# Altium project main_board.PrjPcb
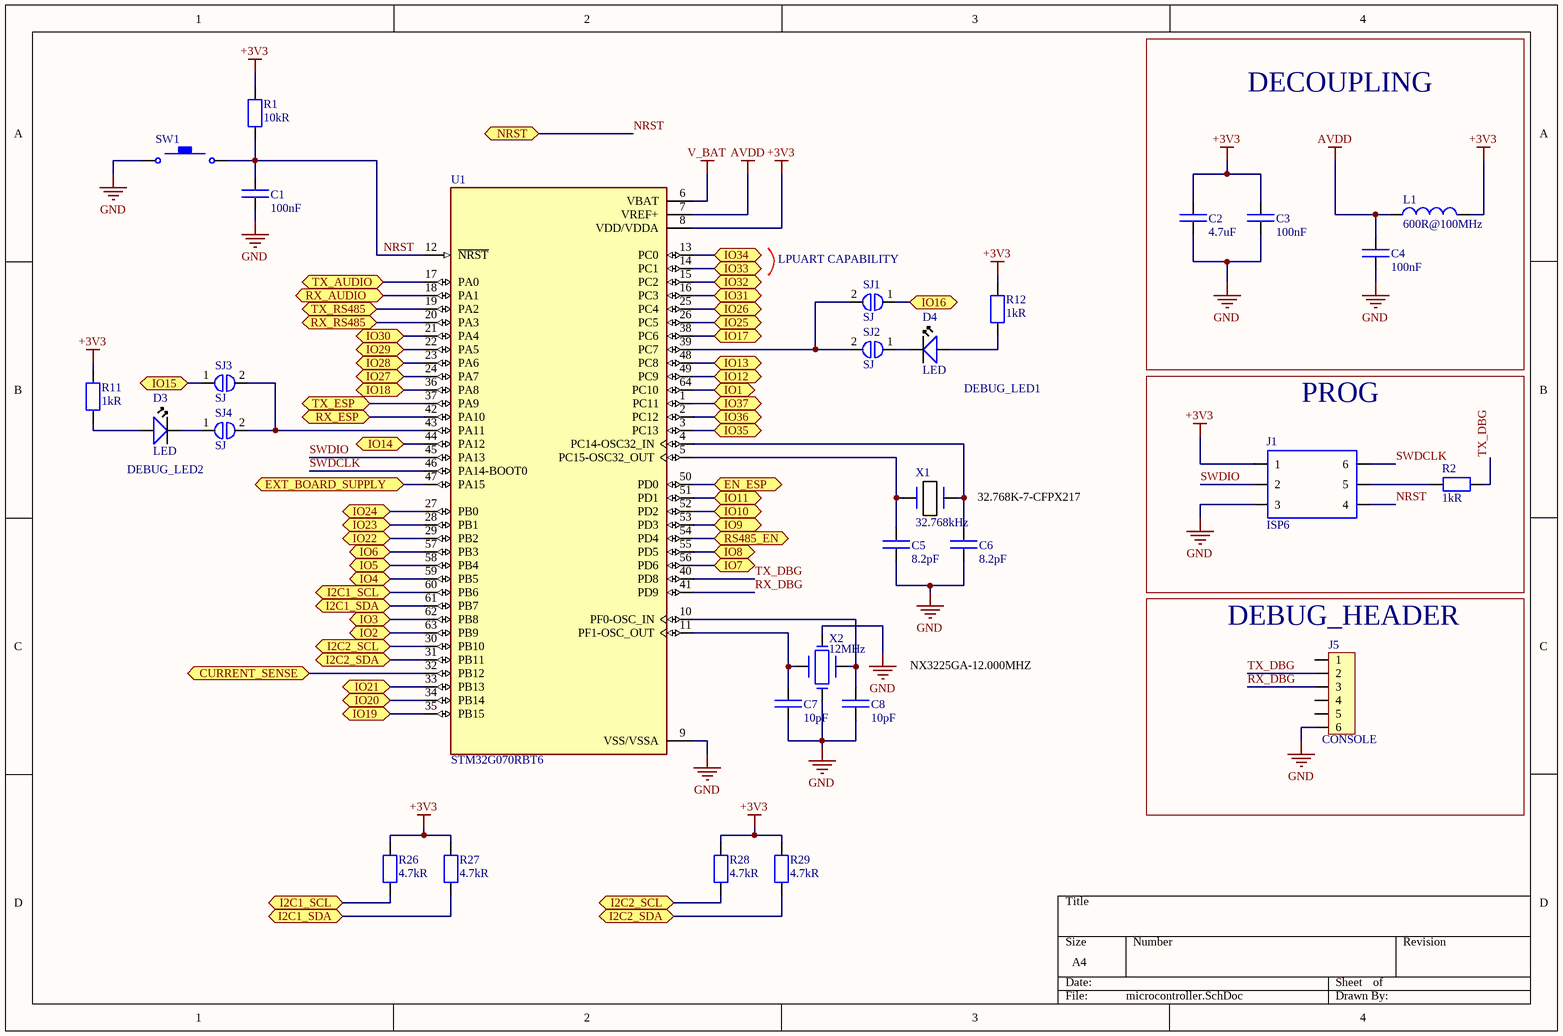
[diagram p0: microcontroller.SchDoc]
6 sheets, 111 parts. Net scope: flat (ports and power ports of the same name join across sheets).
Board file: main_board.PcbDoc
Sheets:
  microcontroller.SchDoc
  power-supply.SchDoc
  Audio.SchDoc
  RS_transceiver.SchDoc
  ESP.SchDoc
  Headers.SchDoc

## Sheet microcontroller.SchDoc
size A4; SheetNumber: 1; SheetTotal: 6

### Parts
C1  100nF  [C0603]
C2  4.7uF  [C0805]
C3  100nF  [C0603]
C4  100nF  [C0603]
C5  8.2pF  [C0603]
C6  8.2pF  [C0603]
C7  10pF  [C0603]
C8  10pF  [C0603]
D3  LED  [LED0805]
D4  LED  [LED0805]
J1  ISP6  [ISP-6]
J5  CONSOLE  [pin_header_6_male]
L1  600R@100MHz  [R0603]
R1  10kR  [R0603]
R2  1kR  [R0603]
R11  1kR  [R0603]
R12  1kR  [R0603]
R26  4.7kR  [R0805]
R27  4.7kR  [R0805]
R28  4.7kR  [R0805]
R29  4.7kR  [R0805]
SJ1  SJ  [SJ]
SJ2  SJ  [SJ]
SJ3  SJ  [SJ]
SJ4  SJ  [SJ]
SW1  tactile_switch  [tact_sw_3mmx4mm]  (value not drawn)
U1  STM32G070RBT6  [STM32]
X1  32.768kHz  [XTAL_2PIN_3.2X1.5mm]
X2  12MHz  [XTAL_4PIN_3.2x2.5mm]

### Blocks framed on the sheet
DECOUPLING: C2-C4 L1
PROG: J1 R2
DEBUG_HEADER: J5

### Ports
CURRENT_SENSE (bidir), EN_ESP (bidir), EXT_BOARD_SUPPLY (bidir), I2C1_SCL (bidir), I2C1_SDA (bidir), I2C2_SCL (bidir), I2C2_SDA (bidir), IO1 (bidir), IO2 (bidir), IO3 (bidir), IO4 (bidir), IO5 (bidir), IO6 (bidir), IO7 (bidir), IO8 (bidir), IO9 (bidir), IO10 (bidir), IO11 (bidir), IO12 (bidir), IO13 (bidir), IO14 (bidir), IO15 (bidir), IO16 (bidir), IO17 (bidir), IO18 (bidir), IO19 (bidir), IO20 (bidir), IO21 (bidir), IO22 (bidir), IO23 (bidir), IO24 (bidir), IO25 (bidir), IO26 (bidir), IO27 (bidir), IO28 (bidir), IO29 (bidir), IO30 (bidir), IO31 (bidir), IO32 (bidir), IO33 (bidir), IO34 (bidir), IO35 (bidir), IO36 (bidir), IO37 (bidir), NRST (bidir), RS485_EN (bidir), RX_AUDIO (bidir), RX_ESP (bidir), RX_RS485 (bidir), TX_AUDIO (bidir), TX_ESP (bidir), TX_RS485 (bidir)

### Nets
+3V3: C2.2 C3.2 J1.1 L1.2 R1.2 R11.2 R12.2 R26.2 R27.2 R28.2 R29.2 U1.8(VDD/VDDA)
AVDD: C4.2 L1.1 U1.7(VREF+)
GND: C1.1 C2.1 C3.1 C4.1 C5.1 C6.1 C7.1 C8.1 J1.3 J5.6 SW1.1 U1.9(VSS/VSSA) X2.2 X2.4
V_BAT: U1.6(VBAT)
NRST: C1.2 J1.4 R1.1 SW1.3 U1.12(~{NRST}) ; port NRST
RX_DBG: J5.3 U1.41(PD9)
SWDCLK: J1.6 U1.46(PA14-BOOT0)
SWDIO: J1.2 U1.45(PA13)
TX_DBG: J5.2 R2.2 U1.40(PD8)
NetC5_2: C5.2 U1.5(PC15-OSC32_OUT) X1.1
NetC6_2: C6.2 U1.4(PC14-OSC32_IN) X1.2
NetC7_2: C7.2 U1.11(PF1-OSC_OUT) X2.1
NetC8_2: C8.2 U1.10(PF0-OSC_IN) X2.3
NetC22_2: U1.32(PB12) ; port CURRENT_SENSE
NetD3_A: D3.A R11.1
NetD3_K: D3.K SJ4.1
NetD4_A: D4.A R12.1
NetD4_K: D4.K SJ2.1
NetD9_K: U1.19(PA2) ; port TX_RS485
NetD10_K: U1.20(PA3) ; port RX_RS485
NetJ1_5: J1.5 R2.1
NetJ7_4: U1.47(PA15) ; port EXT_BOARD_SUPPLY
NetJ7_6: U1.1(PC11) ; port IO37
NetJ7_7: U1.2(PC12) ; port IO36
NetJ7_8: U1.3(PC13) ; port IO35
NetJ7_9: U1.13(PC0) ; port IO34
NetJ7_10: U1.14(PC1) ; port IO33
NetJ7_11: U1.15(PC2) ; port IO32
NetJ7_12: U1.16(PC3) ; port IO31
NetJ7_13: U1.21(PA4) ; port IO30
NetJ7_14: U1.22(PA5) ; port IO29
NetJ7_15: U1.23(PA6) ; port IO28
NetJ7_16: U1.24(PA7) ; port IO27
NetJ7_17: U1.25(PC4) ; port IO26
NetJ7_18: U1.26(PC5) ; port IO25
NetJ7_19: U1.27(PB0) ; port IO24
NetJ7_20: U1.28(PB1) ; port IO23
NetJ7_21: U1.29(PB2) ; port IO22
NetJ7_22: R28.1 U1.30(PB10) ; port I2C2_SCL
NetJ7_23: R29.1 U1.31(PB11) ; port I2C2_SDA
NetJ7_24: U1.33(PB13) ; port IO21
NetJ7_25: U1.34(PB14) ; port IO20
NetJ7_26: U1.35(PB15) ; port IO19
NetJ7_27: U1.36(PA8) ; port IO18
NetJ7_28: U1.38(PC6) ; port IO17
NetJ7_29: SJ1.1 ; port IO16
NetJ7_30: SJ3.1 ; port IO15
NetJ8_1: U1.64(PC10) ; port IO1
NetJ8_2: U1.63(PB9) ; port IO2
NetJ8_3: U1.62(PB8) ; port IO3
NetJ8_4: R27.1 U1.61(PB7) ; port I2C1_SDA
NetJ8_5: R26.1 U1.60(PB6) ; port I2C1_SCL
NetJ8_6: U1.59(PB5) ; port IO4
NetJ8_7: U1.58(PB4) ; port IO5
NetJ8_8: U1.57(PB3) ; port IO6
NetJ8_9: U1.56(PD6) ; port IO7
NetJ8_10: U1.55(PD5) ; port IO8
NetJ8_11: U1.53(PD3) ; port IO9
NetJ8_12: U1.52(PD2) ; port IO10
NetJ8_13: U1.51(PD1) ; port IO11
NetJ8_14: U1.49(PC9) ; port IO12
NetJ8_15: U1.48(PC8) ; port IO13
NetJ8_16: U1.44(PA12) ; port IO14
NetJ10_2: U1.37(PA9) ; port TX_ESP
NetJ10_3: U1.42(PA10) ; port RX_ESP
NetR7_1: U1.17(PA0) ; port TX_AUDIO
NetSJ1_2: SJ1.2 SJ2.2 U1.39(PC7)
NetSJ3_2: SJ3.2 SJ4.2 U1.43(PA11)
NetSJ6_1: U1.50(PD0) ; port EN_ESP
NetU1_18: U1.18(PA1) ; port RX_AUDIO
NetU1_54: U1.54(PD4) ; port RS485_EN

Not connected (* = marked no-connect by the designer): J5 1 4 5

### Notes on the sheet
- (near SJ1) LPUART CAPABILITY
- DEBUG_LED1
- DEBUG_LED2
- 32.768K-7-CFPX217
- NX3225GA-12.000MHZ

### Library data of the parts
C1-C8 = Cap_SMD
J5 = GOLDPIN_6
L1 = Inductor
R1 R2 R11 R12 R26-R29 = Res
U1 = STM32G070RBT6: ARMÂ® CortexÂ®-M0+ STM32G0 Microcontroller IC 32-Bit 64MHz 128KB _128K x 8_ FLASH 64-LQFP _10x10_; MF: STMicroelectronics; Package: LQFP-64 STMicroelectronics; MP: STM32G070RBT6; Value: *; Availability: Unavailable; SnapEDA_Link: https://www.snapeda.com/parts/STM32G070RBT6/STMicroelectronics/view-part/3616430/?ref=snap; Price: None
X1 = XTAL_2PIN: 32.768K-7-CFPX217
X2 = XTAL_4PIN: NX3225GA-12.000MHZ

## Sheet power-supply.SchDoc
size A4; SheetNumber: 2; SheetTotal: 6
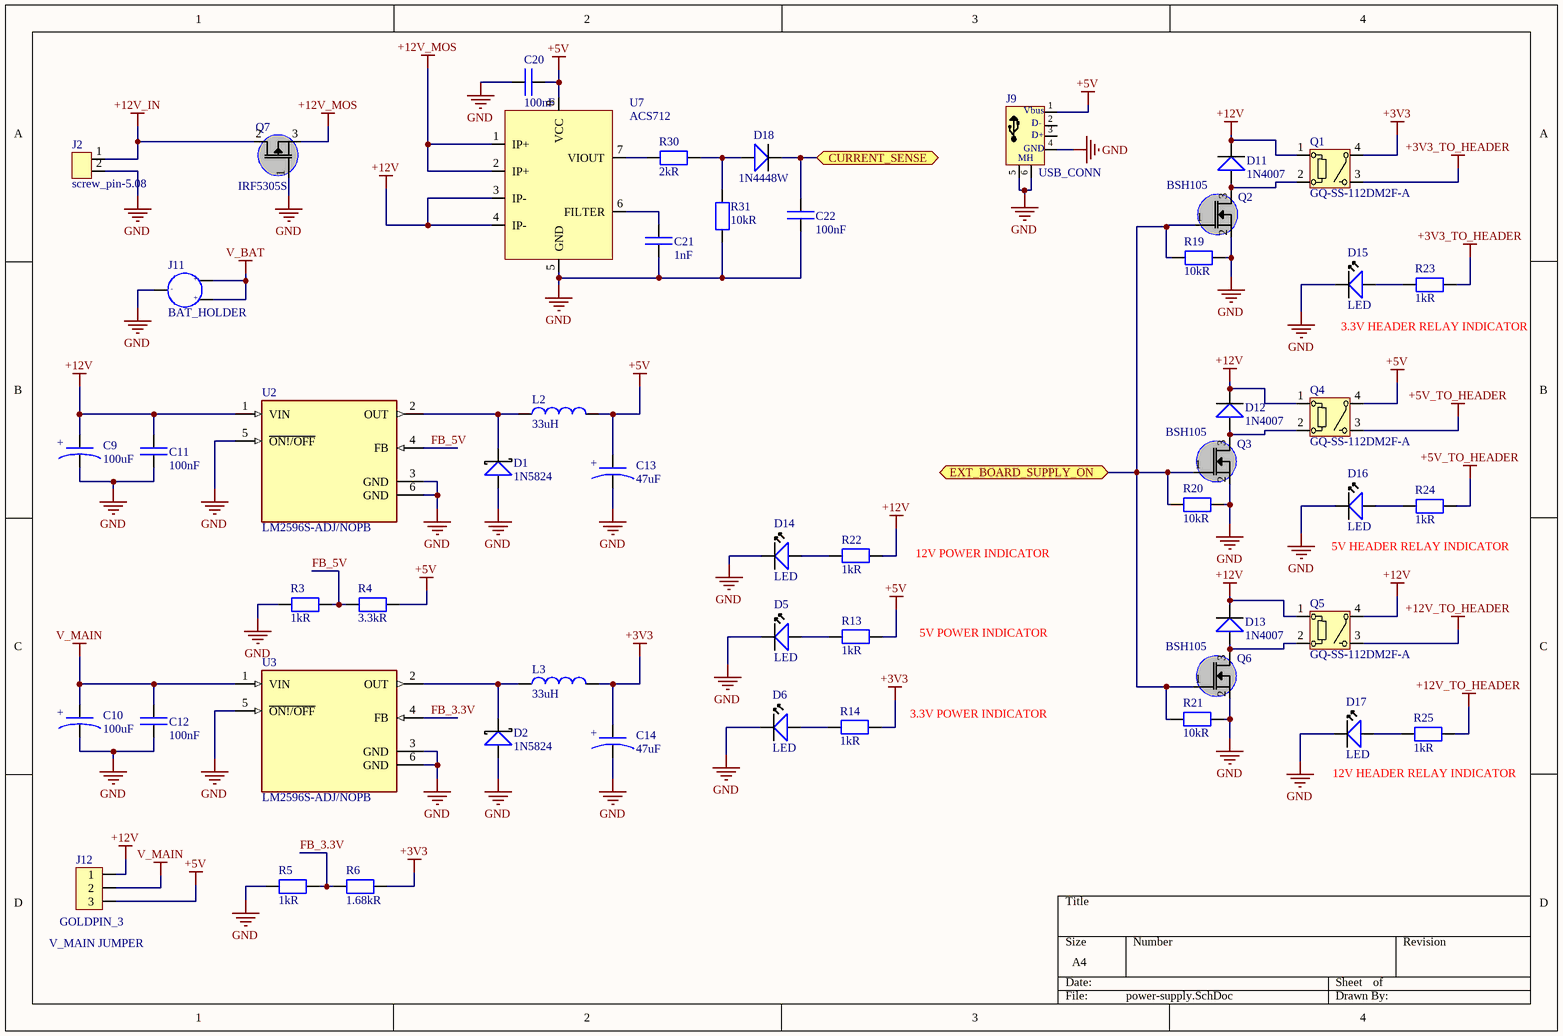
[diagram p1: power-supply.SchDoc]

### Parts
C9  100uF  [C_Pol_6.3x7.7]
C10  100uF  [C_Pol_6.3x7.7]
C11  100nF  [C0603]
C12  100nF  [C0603]
C13  47uF  [C_Pol_6.3x7.7]
C14  47uF  [C_Pol_6.3x7.7]
C20  100nF  [C0603]
C21  1nF  [C0603]
C22  100nF  [C0603]
D1  1N5824  [DO-214AA]
D2  1N5824  [DO-214AA]
D5  LED  [LED0805]
D6  LED  [LED0805]
D11  1N4007  [D_SMA]
D12  1N4007  [D_SMA]
D13  1N4007  [D_SMA]
D14  LED  [LED0805]
D15  LED  [LED0805]
D16  LED  [LED0805]
D17  LED  [LED0805]
D18  1N4448W  [SOD123F]
J2  screw_pin-5.08  [screw_pin-5.08]
J9  USB_CONN  [USB_A]
J11  BAT_HOLDER  [BAT_HOLDER]
J12  GOLDPIN_3  [PIN_HEADER_3_MALE]
L2  33uH  [SRR1260-330M]
L3  33uH  [SRR1260-330M]
Q1  GQ-SS-112DM2F-A  [GQ-SS-112DM2F-a]
Q2  BSH105  [SOT23]
Q3  BSH105  [SOT23]
Q4  GQ-SS-112DM2F-A  [GQ-SS-112DM2F-a]
Q5  GQ-SS-112DM2F-A  [GQ-SS-112DM2F-a]
Q6  BSH105  [SOT23]
Q7  IRF5305S  [DDPAK]
R3  1kR  [R0603]
R4  3.3kR  [R0603]
R5  1kR  [R0603]
R6  1.68kR  [R0603]
R13  1kR  [R0603]
R14  1kR  [R0603]
R19  10kR  [R0805]
R20  10kR  [R0805]
R21  10kR  [R0805]
R22  1kR  [R0603]
R23  1kR  [R0603]
R24  1kR  [R0603]
R25  1kR  [R0603]
R30  2kR  [R0603]
R31  10kR  [R0603]
U2  LM2596S-ADJ/NOPB  [TO-263]
U3  LM2596S-ADJ/NOPB  [TO-263]
U7  ACS712  [SOIC-8]

### Ports
CURRENT_SENSE (bidir), EXT_BOARD_SUPPLY_ON (bidir)

### Nets
+3V3: C14.1 L3.2 Q1.4 R6.2 R14.2
+3V3_TO_HEADER: Q1.3 R23.2
+5V: C13.1 C20.1 J9.1 J12.3 L2.2 Q4.4 R4.2 R13.2 U7.8(VCC)
+5V_TO_HEADER: Q4.3 R24.2
+12V: C9.1 C11.2 D11.K D12.K D13.K J12.1 Q1.1 Q4.1 Q5.1 Q5.4 R22.2 U2.1(VIN) U7.3(IP-) U7.4(IP-)
+12V_IN: J2.1 Q7.2
+12V_MOS: Q7.3 U7.1(IP+) U7.2(IP+)
+12V_TO_HEADER: Q5.3 R25.2
GND: C9.2 C10.2 C11.1 C12.1 C13.2 C14.2 C20.2 C21.1 C22.1 D1.A D2.A D5.K D6.K D14.K D15.K D16.K D17.K J2.2 J9.4 J9.5 J9.6 J11.3(-) Q2.2 Q3.2 Q6.2 Q7.1(G) R3.1 R5.1 R19.2 R20.2 R21.2 R31.1 U2.3(GND) U2.5(~{ON!/OFF}) U2.6(GND) U3.3(GND) U3.5(~{ON!/OFF}) U3.6(GND) U7.5(GND)
V_BAT: J11.1(+) J11.2(+)
V_MAIN: C10.1 C12.2 J12.2 U3.1(VIN)
FB_3.3V: R5.2 R6.1 U3.4(FB)
FB_5V: R3.2 R4.1 U2.4(FB)
NetC21_2: C21.2 U7.6(FILTER)
NetC22_2: C22.2 D18.K ; port CURRENT_SENSE
NetD1_K: D1.K L2.1 U2.2(OUT)
NetD2_K: D2.K L3.1 U3.2(OUT)
NetD5_A: D5.A R13.1
NetD6_A: D6.A R14.1
NetD11_A: D11.A Q1.2 Q2.3
NetD12_A: D12.A Q3.3 Q4.2
NetD13_A: D13.A Q5.2 Q6.3
NetD14_A: D14.A R22.1
NetD15_A: D15.A R23.1
NetD16_A: D16.A R24.1
NetD17_A: D17.A R25.1
NetD18_A: D18.A R30.1 R31.2
NetJ7_1: Q2.1(G) Q3.1(G) Q6.1(G) R19.1 R20.1 R21.1 ; port EXT_BOARD_SUPPLY_ON
NetR30_2: R30.2 U7.7(VIOUT)

Not connected (* = marked no-connect by the designer): J9 2(D-) 3(D+)

### Notes on the sheet
- 3.3V HEADER RELAY INDICATOR
- (near R22) 12V POWER INDICATOR
- 5V HEADER RELAY INDICATOR
- (near R13) 5V POWER INDICATOR
- (near R14) 3.3V POWER INDICATOR
- 12V HEADER RELAY INDICATOR
- (near J12) V_MAIN JUMPER
- (in symbol Cap_SMD_elec) +
- (in symbol USB_CONN) Vbus; GND; MH

### Library data of the parts
C9 C10 C13 C14 = Cap_SMD_elec
C11 C12 C20-C22 = Cap_SMD
D1 D2 = Schottky_diode
D11-D13 D18 = Diode
L2 L3 = Inductor
Q2 Q3 Q6 = MOSFET_N
R3-R6 R13 R14 R19-R25 R30 R31 = Res
U2 U3 = LM2596S-ADJ/NOPB: SIMPLE SWITCHER&reg; 4.5V to 40V, 3A Low Component Count Step-Down Regulator 5-DDPAK/TO-263 -40 to 125; MF: Texas Instruments; MP: LM2596S-ADJ/NOPB; Price: None; Availability: Unavailable; SnapEDA_Link: https://www.snapeda.com/parts/LM2596S-ADJ/NOPB/Texas%20Instruments/view-part/276908/?ref=snap; Texas_Instruments-Purchase-URL: https://snapeda.com/shop?store=Texas+Instruments&id=276908; Value: *; Mouser-Purchase-URL: https://snapeda.com/shop?store=Mouser&id=276908; Package: TO-263-5 Texas Instruments; DigiKey-Purchase-URL: https://snapeda.com/shop?store=DigiKey&id=276908

## Sheet Audio.SchDoc
size A4; SheetNumber: 3; SheetTotal: 6
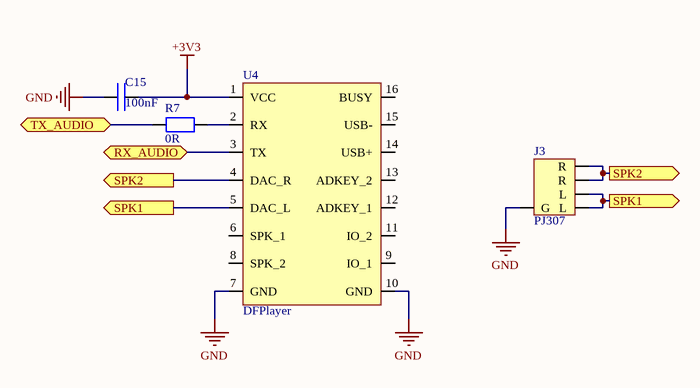
[diagram p2: Audio.SchDoc]

### Parts
C15  100nF  [C0603]
J3  PJ307  [PJ307]
R7  0R  [R0603]
U4  DFPlayer  [DFPLAYER]

### Ports
RX_AUDIO (bidir), SPK1 (out), SPK2 (out), TX_AUDIO (bidir)

### Nets
+3V3: C15.2 U4.1(VCC)
GND: C15.1 J3.1(G) U4.7(GND) U4.10(GND)
NetJ3_2: J3.2(L) J3.3(L) U4.5(DAC_L) ; port SPK1
NetJ3_4: J3.4(R) J3.5(R) U4.4(DAC_R) ; port SPK2
NetR7_1: R7.1 ; port TX_AUDIO
NetR7_2: R7.2 U4.2(RX)
NetU1_18: U4.3(TX) ; port RX_AUDIO

Not connected (* = marked no-connect by the designer): U4 6(SPK_1) 8(SPK_2) 9(IO_1) 11(IO_2) 12(ADKEY_1) 13(ADKEY_2) 14(USB+) 15(USB-) 16(BUSY)

### Library data of the parts
C15 = Cap_SMD
J3 = Jack_3.5mm_PJ307
R7 = Res

## Sheet RS_transceiver.SchDoc
size A4; SheetNumber: 4; SheetTotal: 6
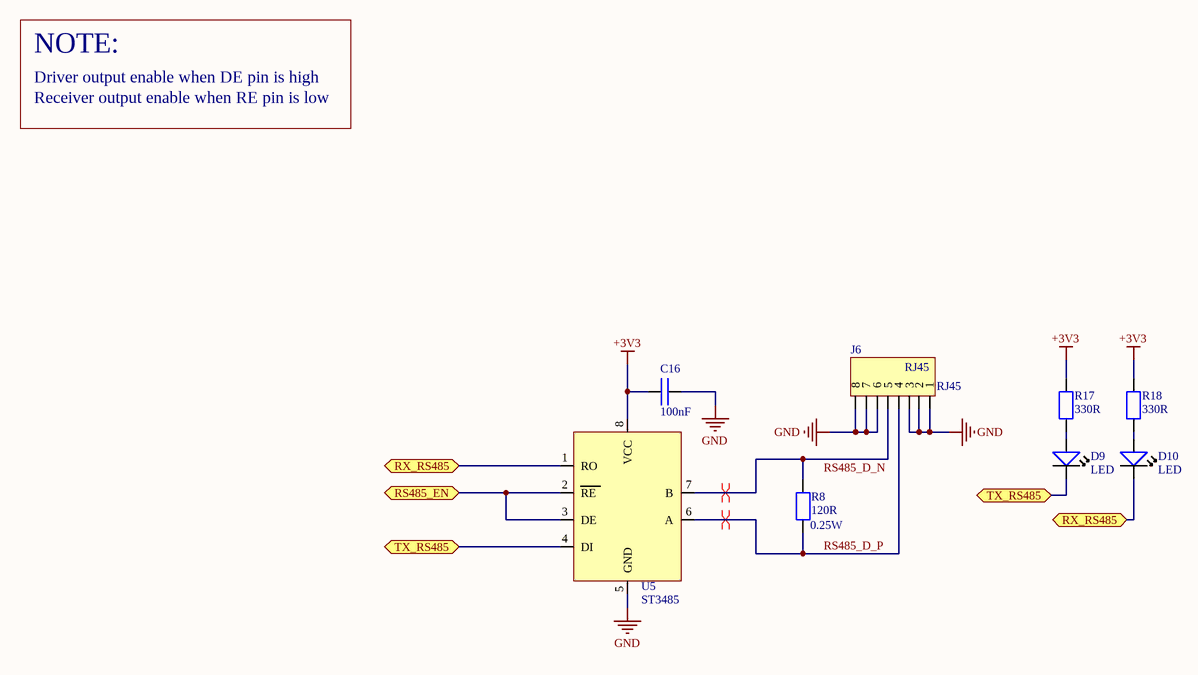
[diagram p3: RS_transceiver.SchDoc]

### Parts
C16  100nF  [C0603]
D9  LED  [LED0805]
D10  LED  [LED0805]
J6  RJ45  [RJ45]
R8  120R  [R0805]
R17  330R  [R0805]
R18  330R  [R0805]
U5  ST3485  [SO8]

### Ports
RS485_EN (bidir), RX_RS485 (bidir), TX_RS485 (bidir)

### Nets
+3V3: C16.2 R17.2 R18.2 U5.8(VCC)
GND: C16.1 J6.1 J6.2 J6.3 J6.6 J6.7 J6.8 U5.5(GND)
RS485_D_N: J6.5 R8.2 U5.7(B)
RS485_D_P: J6.4 R8.1 U5.6(A)
NetD9_A: D9.A R17.1
NetD9_K: D9.K U5.4(DI) ; port TX_RS485
NetD10_A: D10.A R18.1
NetD10_K: D10.K U5.1(RO) ; port RX_RS485
NetU1_54: U5.2(RE) U5.3(DE) ; port RS485_EN

### Layout directives
differential pair: RS485_D_N, RS485_D_P

### Notes on the sheet
- NOTE:
- Driver output enable when DE pin is high
- Receiver output enable when RE pin is low
- (near R8) 0.25W

### Library data of the parts
C16 = Cap_SMD
R8 R17 R18 = Res

## Sheet ESP.SchDoc
size A4; SheetNumber: 5; SheetTotal: 6
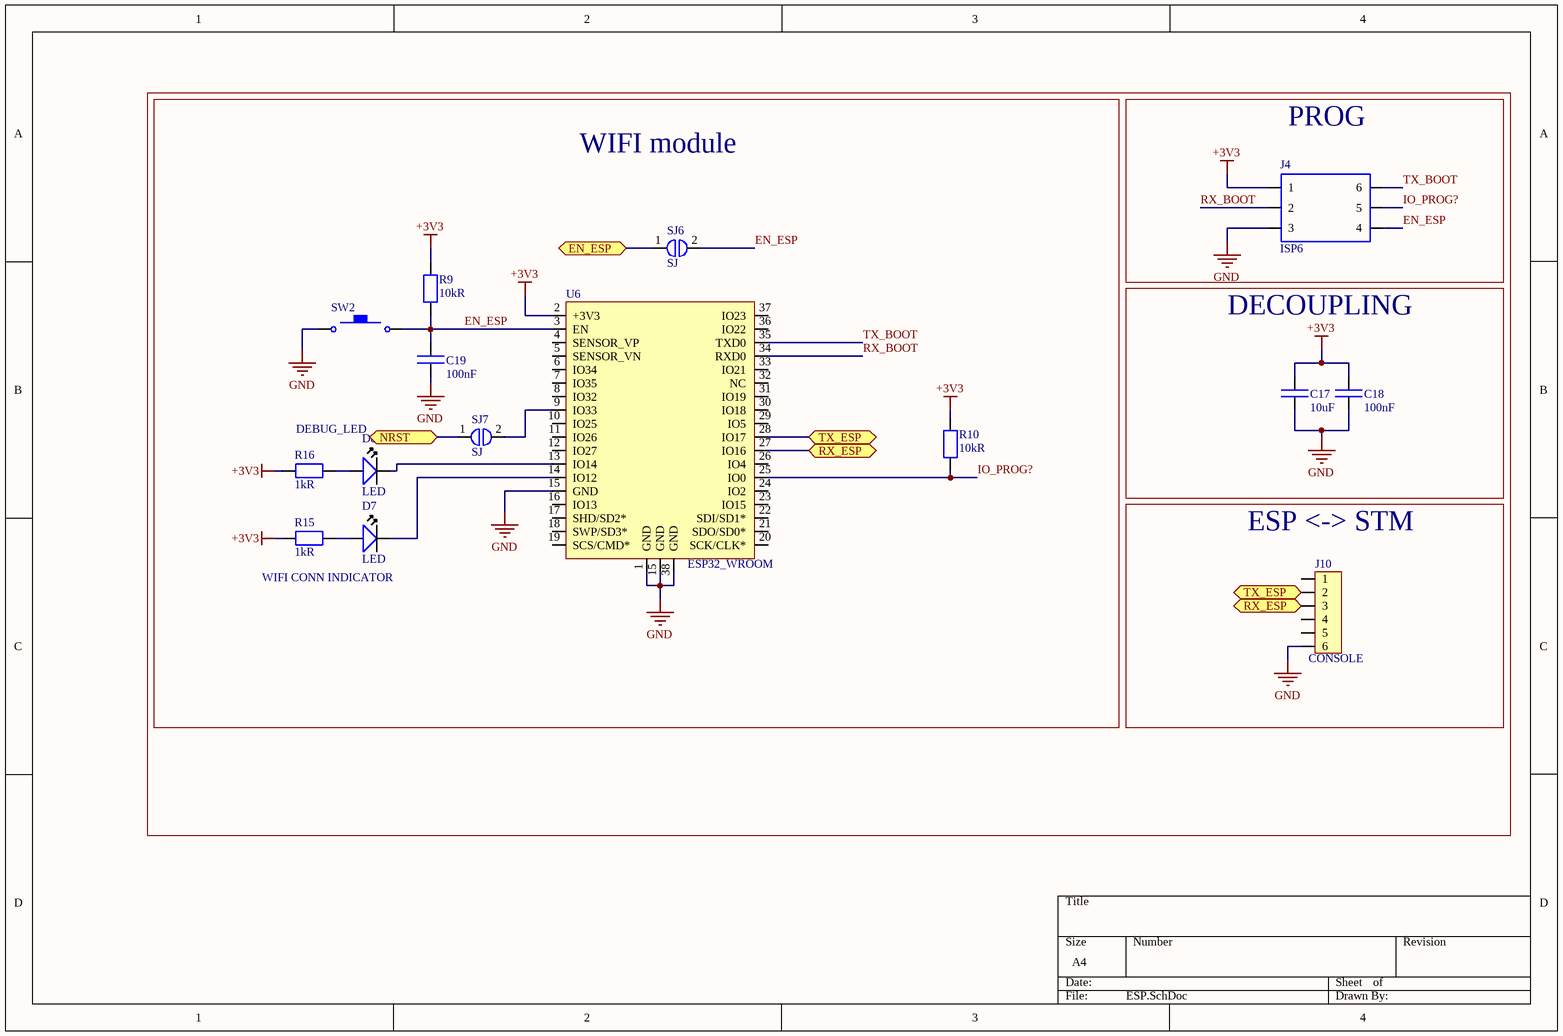
[diagram p4: ESP.SchDoc]

### Parts
C17  10uF  [C0805]
C18  100nF  [C0603]
C19  100nF  [C0603]
D7  LED  [LED0805]
D8  LED  [LED0805]
J4  ISP6  [ISP-6]
J10  CONSOLE  [pin_header_6_male]
R9  10kR  [R0603]
R10  10kR  [R0603]
R15  1kR  [R0603]
R16  1kR  [R0603]
SJ6  SJ  [SJ]
SJ7  SJ  [SJ]
SW2  tactile_switch  [tact_sw_3mmx4mm]  (value not drawn)
U6  ESP32_WROOM  [ESP32-WROOM-32]

### Blocks framed on the sheet
WIFI module: C19 D7 D8 R9 R10 R15 R16 SJ6 SJ7 SW2 U6
PROG: J4
DECOUPLING: C17 C18
ESP <-> STM: J10

### Ports
EN_ESP (bidir), NRST (bidir), RX_ESP (bidir), TX_ESP (bidir)

### Nets
+3V3: C17.1 C18.1 J4.1 R9.2 R10.2 R15.2 R16.2 U6.2(+3V3)
GND: C17.2 C18.2 C19.2 J4.3 J10.6 SW2.1 U6.1(GND) U6.15(GND) U6.38(GND)
EN_ESP: C19.1 J4.4 R9.1 SJ6.2 SW2.3 U6.3(EN)
IO_PROG?: J4.5 R10.1 U6.25(IO0)
NRST: SJ7.1 ; port NRST
RX_BOOT: J4.2 U6.34(RXD0)
TX_BOOT: J4.6 U6.35(TXD0)
NetD7_A: D7.A R15.1
NetD7_K: D7.K U6.14(IO12)
NetD8_A: D8.A R16.1
NetD8_K: D8.K U6.13(IO14)
NetJ10_2: J10.2 U6.28(IO17) ; port TX_ESP
NetJ10_3: J10.3 U6.27(IO16) ; port RX_ESP
NetSJ6_1: SJ6.1 ; port EN_ESP
NetSJ7_2: SJ7.2 U6.9(IO33)

Not connected (* = marked no-connect by the designer): J10 1 4 5; U6 4(SENSOR_VP) 5(SENSOR_VN) 6(IO34) 7(IO35) 8(IO32) 10(IO25) 11(IO26) 12(IO27) 16(IO13) 17(SHD/SD2*) 18(SWP/SD3*) 19(SCS/CMD*) 20(SCK/CLK*) 21(SDO/SD0*) 22(SDI/SD1*) 23(IO15) 24(IO2) 26(IO4) 29(IO5) 30(IO18) 31(IO19) 32(NC) 33(IO21) 36(IO22) 37(IO23)

### Notes on the sheet
- DEBUG_LED
- WIFI CONN INDICATOR

### Library data of the parts
C17-C19 = Cap_SMD
J10 = GOLDPIN_6
R9 R10 R15 R16 = Res
U6 = ESP32_WROOM: pin to pad: 38>38+39

## Sheet Headers.SchDoc
size A4; SheetNumber: 6; SheetTotal: 6
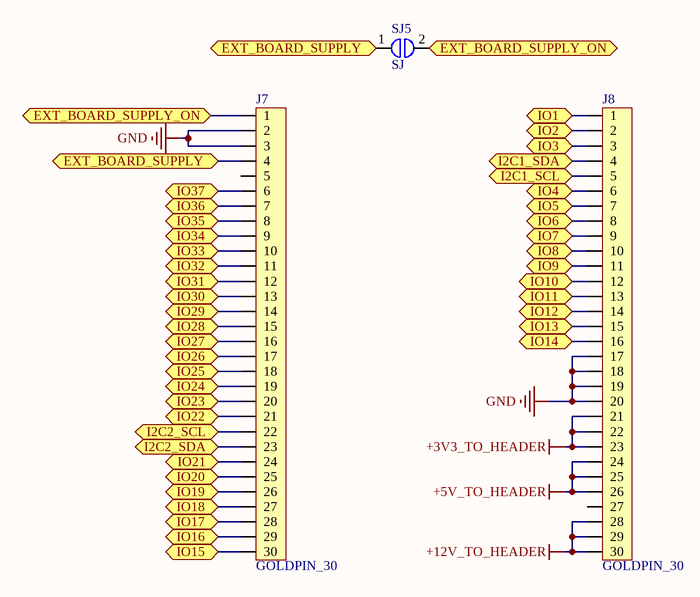
[diagram p5: Headers.SchDoc]

### Parts
J7  GOLDPIN_30  [PIN_HEADER_30_MALE]
J8  GOLDPIN_30  [PIN_HEADER_30_MALE]
SJ5  SJ  [SJ]

### Ports
EXT_BOARD_SUPPLY (bidir), EXT_BOARD_SUPPLY_ON (bidir), I2C1_SCL (bidir), I2C1_SDA (bidir), I2C2_SCL (bidir), I2C2_SDA (bidir), IO1 (bidir), IO2 (bidir), IO3 (bidir), IO4 (bidir), IO5 (bidir), IO6 (bidir), IO7 (bidir), IO8 (bidir), IO9 (bidir), IO10 (bidir), IO11 (bidir), IO12 (bidir), IO13 (bidir), IO14 (bidir), IO15 (bidir), IO16 (bidir), IO17 (bidir), IO18 (bidir), IO19 (bidir), IO20 (bidir), IO21 (bidir), IO22 (bidir), IO23 (bidir), IO24 (bidir), IO25 (bidir), IO26 (bidir), IO27 (bidir), IO28 (bidir), IO29 (bidir), IO30 (bidir), IO31 (bidir), IO32 (bidir), IO33 (bidir), IO34 (bidir), IO35 (bidir), IO36 (bidir), IO37 (bidir)

### Nets
+3V3_TO_HEADER: J8.21 J8.22 J8.23
+5V_TO_HEADER: J8.24 J8.25 J8.26
+12V_TO_HEADER: J8.28 J8.29 J8.30
GND: J7.2 J7.3 J8.17 J8.18 J8.19 J8.20
NetJ7_1: J7.1 SJ5.2 ; port EXT_BOARD_SUPPLY_ON
NetJ7_4: J7.4 SJ5.1 ; port EXT_BOARD_SUPPLY
NetJ7_6: J7.6 ; port IO37
NetJ7_7: J7.7 ; port IO36
NetJ7_8: J7.8 ; port IO35
NetJ7_9: J7.9 ; port IO34
NetJ7_10: J7.10 ; port IO33
NetJ7_11: J7.11 ; port IO32
NetJ7_12: J7.12 ; port IO31
NetJ7_13: J7.13 ; port IO30
NetJ7_14: J7.14 ; port IO29
NetJ7_15: J7.15 ; port IO28
NetJ7_16: J7.16 ; port IO27
NetJ7_17: J7.17 ; port IO26
NetJ7_18: J7.18 ; port IO25
NetJ7_19: J7.19 ; port IO24
NetJ7_20: J7.20 ; port IO23
NetJ7_21: J7.21 ; port IO22
NetJ7_22: J7.22 ; port I2C2_SCL
NetJ7_23: J7.23 ; port I2C2_SDA
NetJ7_24: J7.24 ; port IO21
NetJ7_25: J7.25 ; port IO20
NetJ7_26: J7.26 ; port IO19
NetJ7_27: J7.27 ; port IO18
NetJ7_28: J7.28 ; port IO17
NetJ7_29: J7.29 ; port IO16
NetJ7_30: J7.30 ; port IO15
NetJ8_1: J8.1 ; port IO1
NetJ8_2: J8.2 ; port IO2
NetJ8_3: J8.3 ; port IO3
NetJ8_4: J8.4 ; port I2C1_SDA
NetJ8_5: J8.5 ; port I2C1_SCL
NetJ8_6: J8.6 ; port IO4
NetJ8_7: J8.7 ; port IO5
NetJ8_8: J8.8 ; port IO6
NetJ8_9: J8.9 ; port IO7
NetJ8_10: J8.10 ; port IO8
NetJ8_11: J8.11 ; port IO9
NetJ8_12: J8.12 ; port IO10
NetJ8_13: J8.13 ; port IO11
NetJ8_14: J8.14 ; port IO12
NetJ8_15: J8.15 ; port IO13
NetJ8_16: J8.16 ; port IO14

Not connected (* = marked no-connect by the designer): J7 5; J8 27

## Nets that join several sheets
+3V3: microcontroller (12 pins), power-supply (5 pins), Audio (C15.2 U4.1), RS_transceiver (C16.2 R17.2 R18.2 U5.8), ESP (8 pins)
+3V3_TO_HEADER: power-supply (Q1.3 R23.2), Headers (J8.21 J8.22 J8.23)
+5V_TO_HEADER: power-supply (Q4.3 R24.2), Headers (J8.24 J8.25 J8.26)
+12V_TO_HEADER: power-supply (Q5.3 R25.2), Headers (J8.28 J8.29 J8.30)
GND: microcontroller (14 pins), power-supply (39 pins), Audio (C15.1 J3.1 U4.7 U4.10), RS_transceiver (8 pins), ESP (9 pins), Headers (6 pins)
V_BAT: microcontroller (U1.6), power-supply (J11.1 J11.2)
NetC22_2: microcontroller (U1.32), power-supply (C22.2 D18.K)
NetD9_K: microcontroller (U1.19), RS_transceiver (D9.K U5.4)
NetD10_K: microcontroller (U1.20), RS_transceiver (D10.K U5.1)
NetJ7_1: power-supply (6 pins), Headers (J7.1 SJ5.2)
NetJ7_4: microcontroller (U1.47), Headers (J7.4 SJ5.1)
NetJ7_6: microcontroller (U1.1), Headers (J7.6)
NetJ7_7: microcontroller (U1.2), Headers (J7.7)
NetJ7_8: microcontroller (U1.3), Headers (J7.8)
NetJ7_9: microcontroller (U1.13), Headers (J7.9)
NetJ7_10: microcontroller (U1.14), Headers (J7.10)
NetJ7_11: microcontroller (U1.15), Headers (J7.11)
NetJ7_12: microcontroller (U1.16), Headers (J7.12)
NetJ7_13: microcontroller (U1.21), Headers (J7.13)
NetJ7_14: microcontroller (U1.22), Headers (J7.14)
NetJ7_15: microcontroller (U1.23), Headers (J7.15)
NetJ7_16: microcontroller (U1.24), Headers (J7.16)
NetJ7_17: microcontroller (U1.25), Headers (J7.17)
NetJ7_18: microcontroller (U1.26), Headers (J7.18)
NetJ7_19: microcontroller (U1.27), Headers (J7.19)
NetJ7_20: microcontroller (U1.28), Headers (J7.20)
NetJ7_21: microcontroller (U1.29), Headers (J7.21)
NetJ7_22: microcontroller (R28.1 U1.30), Headers (J7.22)
NetJ7_23: microcontroller (R29.1 U1.31), Headers (J7.23)
NetJ7_24: microcontroller (U1.33), Headers (J7.24)
NetJ7_25: microcontroller (U1.34), Headers (J7.25)
NetJ7_26: microcontroller (U1.35), Headers (J7.26)
NetJ7_27: microcontroller (U1.36), Headers (J7.27)
NetJ7_28: microcontroller (U1.38), Headers (J7.28)
NetJ7_29: microcontroller (SJ1.1), Headers (J7.29)
NetJ7_30: microcontroller (SJ3.1), Headers (J7.30)
NetJ8_1: microcontroller (U1.64), Headers (J8.1)
NetJ8_2: microcontroller (U1.63), Headers (J8.2)
NetJ8_3: microcontroller (U1.62), Headers (J8.3)
NetJ8_4: microcontroller (R27.1 U1.61), Headers (J8.4)
NetJ8_5: microcontroller (R26.1 U1.60), Headers (J8.5)
NetJ8_6: microcontroller (U1.59), Headers (J8.6)
NetJ8_7: microcontroller (U1.58), Headers (J8.7)
NetJ8_8: microcontroller (U1.57), Headers (J8.8)
NetJ8_9: microcontroller (U1.56), Headers (J8.9)
NetJ8_10: microcontroller (U1.55), Headers (J8.10)
NetJ8_11: microcontroller (U1.53), Headers (J8.11)
NetJ8_12: microcontroller (U1.52), Headers (J8.12)
NetJ8_13: microcontroller (U1.51), Headers (J8.13)
NetJ8_14: microcontroller (U1.49), Headers (J8.14)
NetJ8_15: microcontroller (U1.48), Headers (J8.15)
NetJ8_16: microcontroller (U1.44), Headers (J8.16)
NetJ10_2: microcontroller (U1.37), ESP (J10.2 U6.28)
NetJ10_3: microcontroller (U1.42), ESP (J10.3 U6.27)
NetR7_1: microcontroller (U1.17), Audio (R7.1)
NetSJ6_1: microcontroller (U1.50), ESP (SJ6.1)
NetU1_18: microcontroller (U1.18), Audio (U4.3)
NetU1_54: microcontroller (U1.54), RS_transceiver (U5.2 U5.3)
NRST: microcontroller (5 pins), ESP (SJ7.1)